# EasyEDA Pro project ProProject_Driver_STM32F405_2023-10-07.epro, schematic Schematic1_5
Create Date: 2023-04-22; Page Name: P1; Project Name: Driver_STM32F405; Schematic Name: Schematic1_5; Update Date: 2023-06-13; Company: 嘉立创EDA; Page Size: A4; Version: V1.0
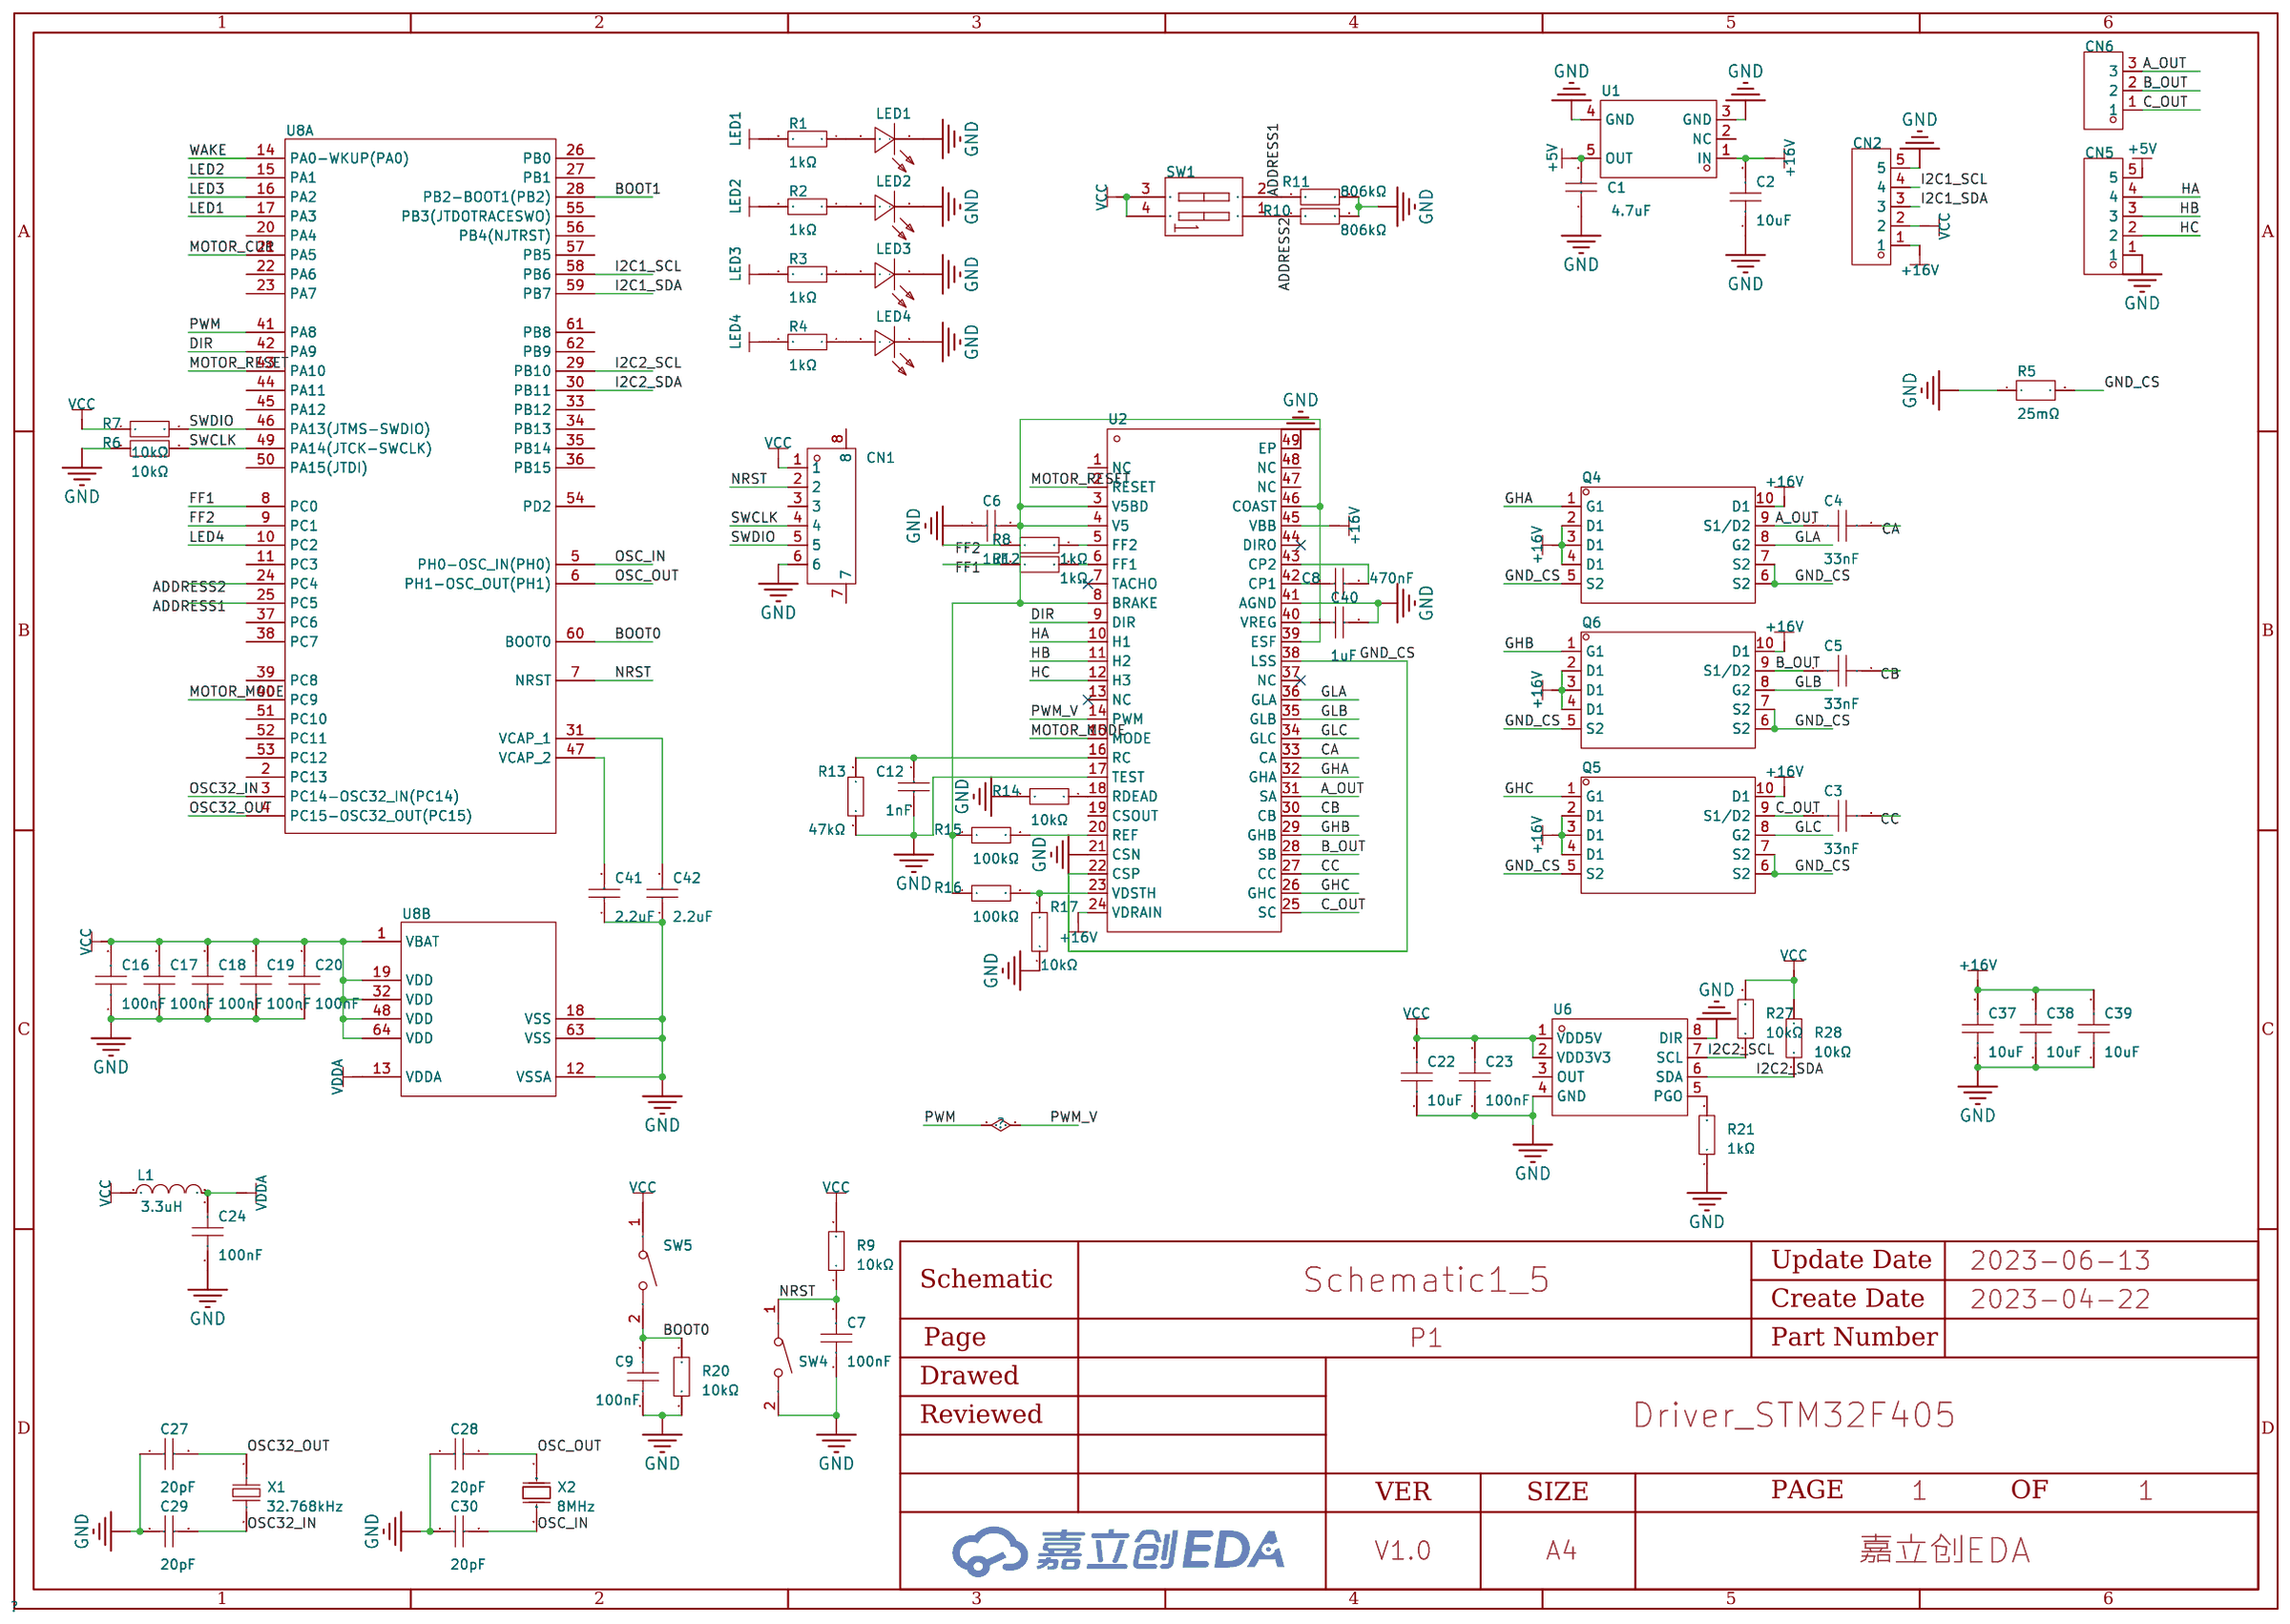
[diagram p1: schematic sheet]

## Parts
C1  4.7uF  [C0603]
C2  10uF  [C0603]
C3  33nF  [C0603]
C4  33nF  [C0603]
C5  33nF  [C0603]
C6  1uF  [C0603]
C7  100nF  [C0603]
C8  470nF  [C0603]
C9  100nF  [C0603]
C12  1nF  [C0603]
C16  100nF  [C0603]
C17  100nF  [C0603]
C18  100nF  [C0603]
C19  100nF  [C0603]
C20  100nF  [C0603]
C22  10uF  [C0603]
C23  100nF  [C0603]
C24  100nF  [C0603]
C27  20pF  [C0603]
C28  20pF  [C0603]
C29  20pF  [C0603]
C30  20pF  [C0603]
C37  10uF  [C1206]
C38  10uF  [C1206]
C39  10uF  [C1206]
C40  1uF  [C0603]
C41  2.2uF  [C0603]
C42  2.2uF  [C0603]
CN1  532610671  [CONN-SMD_6P-P1.25_53261-0671]
CN2  5264-5AWD米色  [CONN-TH_5P-P2.50_5264-5AWD]
CN5  PH-5AW  [CONN-TH_5P-P2.00_PH-5AW_C2908637]
CN6  PH-3AW  [CONN-TH_3P-P2.00_HCTL_PH-3AW_C2908635]
L1  3.3uH  [L0603]
LED1  SZYY0805B  [LED0805-R-RD_BLUE]
LED2  SZYY0805B  [LED0805-R-RD_BLUE]
LED3  SZYY0805B  [LED0805-R-RD_BLUE]
LED4  SZYY0805B  [LED0805-R-RD_BLUE]
Q4  DMT3009LDT-7  [V-DFN3030-8K_L3.0-W3.0-P0.65-BL]
Q5  DMT3009LDT-7  [V-DFN3030-8K_L3.0-W3.0-P0.65-BL]
Q6  DMT3009LDT-7  [V-DFN3030-8K_L3.0-W3.0-P0.65-BL]
R1  1kΩ  [R0603]
R2  1kΩ  [R0603]
R3  1kΩ  [R0603]
R4  1kΩ  [R0603]
R5  25mΩ  [RES-SMD_L6.4-W3.2-R2512]
R6  10kΩ  [R0603]
R7  10kΩ  [R0603]
R8  1kΩ  [R0603]
R9  10kΩ  [R0603]
R10  806kΩ  [R0603]
R11  806kΩ  [R0603]
R12  1kΩ  [R0603]
R13  47kΩ  [R0603]
R14  10kΩ  [R0603]
R15  100kΩ  [R0603]
R16  100kΩ  [R0603]
R17  10kΩ  [R0603]
R20  10kΩ  [R0603]
R21  1kΩ  [R0603]
R27  10kΩ  [R0603]
R28  10kΩ  [R0603]
SW1  DSHP02TSGER  [SW-SMD_DSHP02TSGER]
SW4  TS-1088-AR02016  [SW-SMD_L3.9-W3.0-P4.45]
SW5  TS-1088-AR02016  [SW-SMD_L3.9-W3.0-P4.45]
U1  TPS7B6950DBVR  [SOT-23-5_L3.0-W1.7-P0.95-LS2.8-BL]
U2  A3930KJPTR-T  [LQFP-48_L7.0-W7.0-P0.50-LS9.0-BL-EP]
U6  AS5600-ASOT  [SOIC-8_L5.0-W4.0-P1.27-LS6.0-BL]
U8  STM32F405RGT6  [LQFP-64_L10.0-W10.0-P0.50-LS12.0-BL]  (sections 1,2)
X1  32.768kHz  [FC-135R_L3.2-W1.5]
X2  8MHz  [CRYSTAL-SMD_L5.0-W3.2]

## Library data of the parts
C1 = CL10A475KO8NNNC: 温度系数:X5R;精度:±10%;容值:4.7uF;额定电压:16V;; LCSC Part Name: 4.7uF ±10% 16V; Supplier Part: C19666; Manufacturer: SAMSUNG(三星); Supplier Footprint: 0603; JLCPCB Part Class: Basic Part; Datasheet: https://atta.szlcsc.com/upload/public/pdf/source/20160103/1457707703134.pdf; Supplier: LCSC; Temperature Coefficient: X5R; Tolerance: ±10%; Voltage Rated: 16V
C2 C22 = GRM188C80G106KE47D: 容值:10uF;精度:±10%;额定电压:-;材质(温度系数):-;; LCSC Part Name: 10uF ±10%; Supplier Part: C710916; Manufacturer: muRata(村田); Supplier Footprint: 0603; JLCPCB Part Class: Extended Part; Datasheet: https://atta.szlcsc.com/upload/public/pdf/source/20210205/C710916_8901BCC8D8E6CC54F2C999D22152DEF1.pdf; Supplier: LCSC; Tolerance: ±10%
C3-C5 = CL10B333JB8NNNC: 容值:33nF;精度:±5%;额定电压:50V;材质(温度系数):X7R;; LCSC Part Name: 33nF ±5% 50V; Supplier Part: C377760; Manufacturer: SAMSUNG(三星); Supplier Footprint: 0603; JLCPCB Part Class: Extended Part; Datasheet: https://atta.szlcsc.com/upload/public/pdf/source/20190322/C377760_4801615B1239BA7CCDCF452430F04471.pdf; Supplier: LCSC; Tolerance: ±5%; Voltage Rated: 50V; Temperature Coefficient: X7R
C6 C40 = CL10A105KB8NNNC: 容值:1uF;精度:±10%;额定电压:50V;材质(温度系数):X5R;; LCSC Part Name: 1uF ±10% 50V; Supplier Part: C15849; Manufacturer: SAMSUNG(三星); Supplier Footprint: 0603; JLCPCB Part Class: Basic Part; Datasheet: https://atta.szlcsc.com/upload/public/pdf/source/20160103/1457707679084.pdf; Supplier: LCSC; Tolerance: ±10%; Voltage Rated: 50V; Temperature Coefficient: X5R
C7 C9 C16-C20 C23 C24 = TCC0603X7R104K500CT: 容值:100nF;精度:±10%;额定电压:50V;材质(温度系数):X7R;; LCSC Part Name: 100nF ±10% 50V; Supplier Part: C282519; Manufacturer: CCTC(三环); Supplier Footprint: 0603; JLCPCB Part Class: Extended Part; Datasheet: https://atta.szlcsc.com/upload/public/pdf/source/20180917/C282519_8CE721FA29EE85BB321020B63D7877A0.pdf; Supplier: LCSC; Tolerance: ±10%; Voltage Rated: 50V; Temperature Coefficient: X7R
C8 = 0603B474K500NT: 容值:470nF;精度:±10%;额定电压:50V;材质(温度系数):X7R;; LCSC Part Name: 470nF ±10% 50V; Supplier Part: C77572; Manufacturer: FH(风华); Supplier Footprint: 0603; JLCPCB Part Class: Extended Part; Datasheet: https://atta.szlcsc.com/upload/public/pdf/source/20170923/C77572_1506149543326988941.pdf; Supplier: LCSC; Tolerance: ±10%; Voltage Rated: 50V; Temperature Coefficient: X7R
C12 = CL10B102KB8NNNC: 容值:1nF;精度:±10%;额定电压:50V;材质(温度系数):X7R;; LCSC Part Name: 1nF ±10% 50V; Supplier Part: C1588; Manufacturer: SAMSUNG(三星); Supplier Footprint: 0603; JLCPCB Part Class: Basic Part; Datasheet: https://atta.szlcsc.com/upload/public/pdf/source/20160103/1457707679526.pdf; Supplier: LCSC; Tolerance: ±10%; Voltage Rated: 50V; Temperature Coefficient: X7R
C27-C30 = CL10C200JB8NNNC: 容值:20pF;精度:±5%;额定电压:50V;材质(温度系数):C0G;; LCSC Part Name: 20pF ±5% 50V; Supplier Part: C1648; Manufacturer: SAMSUNG(三星); Supplier Footprint: 0603; JLCPCB Part Class: Basic Part; Datasheet: https://atta.szlcsc.com/upload/public/pdf/source/20160103/1457707686863.pdf; Supplier: LCSC; Tolerance: ±5%; Voltage Rated: 50V; Temperature Coefficient: C0G
C37-C39 = GRM31CB31H106KA12L: 容值:10uF;精度:±10%;额定电压:50V;材质(温度系数):B;; LCSC Part Name: 10uF ±10% 50V; Supplier Part: C521234; Manufacturer: muRata(村田); Supplier Footprint: 1206; JLCPCB Part Class: Extended Part; Datasheet: https://atta.szlcsc.com/upload/public/pdf/source/20200424/C521234_36A2086CC2FC59561FA20FEB9FAD436A.pdf; Supplier: LCSC; Tolerance: ±10%; Voltage Rated: 50V; Temperature Coefficient: B
C41 C42 = CL10A225KO8NNNC: 容值:2.2uF;精度:±10%;额定电压:16V;材质(温度系数):X5R;; LCSC Part Name: 2.2uF ±10% 16V; Supplier Part: C23630; Manufacturer: SAMSUNG(三星); Supplier Footprint: 0603; JLCPCB Part Class: Basic Part; Datasheet: https://atta.szlcsc.com/upload/public/pdf/source/20160103/1457707709512.pdf; Supplier: LCSC; Tolerance: ±10%; Voltage Rated: 16V; Temperature Coefficient: X5R
CN1 = 532610671: 参考系列:-;间距:1.25mm;插针结构:1x6P;排数:1;每排PIN数:6;行距:-;安装方式:-;触头材质:青铜;; LCSC Part Name: 1.25mm 1x6P; Supplier Part: C99277; Manufacturer: MOLEX; JLCPCB Part Class: Extended Part; Datasheet: https://atta.szlcsc.com/upload/public/pdf/source/20180713/C99277_7A4A98FEF11A2209B5FFC17F14BF7E54.pdf; Supplier: LCSC; Pitch: 1.25mm; Pins Structure: 1x6P; Number of Rows: 1; Number of PINs Per Row: 6; Contact Material: 青铜
CN2 = 5264-5AWD米色: 参考系列:-;间距:2.5mm;插针结构:1x5P;排数:1;每排PIN数:5;行距:-;安装方式:-;触头材质:磷青铜;; LCSC Part Name: 5264插座 1*5P 弯针 带定位; Supplier Part: C176652; Manufacturer: BOOMELE(博穆精密); Supplier Footprint: 插件,P=2.5mm; JLCPCB Part Class: Extended Part; Datasheet: https://atta.szlcsc.com/upload/public/pdf/source/20180125/C176652_15168701824541304803.pdf; Supplier: LCSC; Pitch: 2.5mm; Pins Structure: 1x5P; Number of Rows: 1; Number of PINs Per Row: 5; Contact Material: 磷青铜
CN5 = PH-5AW_C2908637: 参考系列:-;间距:2mm;插针结构:1x5P;排数:1;每排PIN数:5;行距:-;公母:公型插针;安装方式:弯插;额定电流:3A;工作温度范围:-20℃~+85℃;; LCSC Part Name: 2mm 1x5P 弯插; Supplier Part: C2908637; Manufacturer: HCTL(华灿天禄); Supplier Footprint: 弯插,P=2mm; JLCPCB Part Class: Extended Part; Datasheet: https://atta.szlcsc.com/upload/public/pdf/source/20211021/A565F63A87FDD0E69746DCB0C2A69E14.pdf; Supplier: LCSC; Pitch: 2mm; Pins Structure: 1x5P; Number of Rows: 1; Number of PINs Per Row: 5; Gender: 公型插针; Mounting Style: 弯插; Current Rating (Max): 3A; Operating Temperature Range: -20℃~+85℃
CN6 = PH-3AW_C2908635: 参考系列:-;间距:2mm;插针结构:1x3P;排数:1;每排PIN数:3;行距:-;公母:公型插针;安装方式:弯插;额定电流:3A;工作温度范围:-20℃~+85℃;; LCSC Part Name: 2mm 1x3P 弯插; Supplier Part: C2908635; Manufacturer: HCTL(华灿天禄); Supplier Footprint: 弯插,P=2mm; JLCPCB Part Class: Extended Part; Datasheet: https://atta.szlcsc.com/upload/public/pdf/source/20211021/A565F63A87FDD0E69746DCB0C2A69E14.pdf; Supplier: LCSC; Pitch: 2mm; Pins Structure: 1x3P; Number of Rows: 1; Number of PINs Per Row: 3; Gender: 公型插针; Mounting Style: 弯插; Current Rating (Max): 3A; Operating Temperature Range: -20℃~+85℃
L1 = CMI160808U3R3KT: 额定电流:15mA;电感值:3.3uH;精度:±10%;饱和电流(Isat):-;直流电阻(DCR):1Ω;; LCSC Part Name: 3.3uH ±10% 15mA 1Ω; Supplier Part: C139209; Manufacturer: FH(风华); Supplier Footprint: 0603; JLCPCB Part Class: Extended Part; Datasheet: https://atta.szlcsc.com/upload/public/pdf/source/20180412/C139209_76E8EB9664C870BAE46EFE11DEB22A4C.pdf; Supplier: LCSC; Rated Current: 15mA; Tolerance: ±10%; DC Resistance (DCR): 1Ω
LED1-LED4 = SZYY0805B: 发光颜色:蓝灯;二极管配置:-;透镜颜色:无色透明;主波长:460nm~475nm;峰值波长:469nm;色温:-;光通量(25时):-;测试电流:5mA;正向电压(VF):3.1V;发光强度:100mcd;功率:100mW;发光角度:120°;安装方式:-;工作温度:-40~+85;; LCSC Part Name: 蓝灯; Supplier Part: C434433; Manufacturer: yongyu(永裕光电); Supplier Footprint: 0805; JLCPCB Part Class: Extended Part; Datasheet: https://atta.szlcsc.com/upload/public/pdf/source/20191204/C434433_0B90CAB876449C52BDD12D5E48F83BBD.pdf; Supplier: LCSC; Emitted Color: 蓝灯; Lens Color: 无色透明; Dominant Wavelength: 460nm~475nm; Peak Wavelength: 469nm; Forward Current: 5mA; Forward Voltage (VF): 3.1V; Luminous Intensity: 100mcd; Power Dissipation: 100mW; Viewing Angle: 120°; Operating Temperature: -40~+85
Q4-Q6 = DMT3009LDT-7: 类型:双N沟道(半桥);漏源电压(Vdss):30V;连续漏极电流(Id):30A;功率(Pd):1.2W;导通电阻(RDS(on)@Vgs,Id):11.1mΩ@10V,14.4A;阈值电压(Vgs(th)@Id):3V@250uA;; LCSC Part Name: 双N沟道(半桥) 30V 30A; Supplier Part: C155503; Manufacturer: DIODES(美台); Supplier Footprint: V-DFN3030-8; JLCPCB Part Class: Extended Part; Datasheet: https://atta.szlcsc.com/upload/public/pdf/source/20181206/C155503_C9E5F849506B8E5BF51429E256EC4CEC.pdf; Supplier: LCSC; Type: 双N沟道(半桥); Drain Source Voltage (Vdss): 30V; Continuous Drain Current (Id): 30A; Power Dissipation (Pd): 1.2W; Drain Source On Resistance (RDS(on)@Vgs,Id): 11.1mΩ@10V,14.4A; Gate Threshold Voltage (Vgs(th)@Id): 3V@250uA
R1-R4 R8 R12 R21 = 0603WAF1001T5E: 电阻类型:厚膜电阻;阻值:1kΩ;精度:±1%;功率:100mW;温度系数:±100ppm/℃;最大工作电压:75V;工作温度范围:-55℃~+155℃;; LCSC Part Name: 1kΩ ±1% 100mW; Supplier Part: C21190; Manufacturer: UNI-ROYAL(厚声); Supplier Footprint: 0603; JLCPCB Part Class: Basic Part; Datasheet: https://atta.szlcsc.com/upload/public/pdf/source/20200306/C422600_1E6D84923E4A46A82E41ADD87F860B5C.pdf; Supplier: LCSC; Type: 厚膜电阻; Tolerance: ±1%; Power(Watts): 100mW; Temperature Coefficient: ±100ppm/℃; Overload Voltage (Max): 75V; Operating Temperature Range: -55℃~+155℃
R5 = HoJLR2512-3W-25mR-1%: 阻值:25mΩ;精度:±1%;功率:3W;温度系数:±50ppm/℃;工作温度范围:-50℃~+170℃;; LCSC Part Name: 25mΩ ±1% 3W; Supplier Part: C2903480; Manufacturer: Milliohm(毫欧); Supplier Footprint: 2512; JLCPCB Part Class: Extended Part; Datasheet: https://atta.szlcsc.com/upload/public/pdf/source/20211009/7525CABAB363C979E942C1DD41F1FEF0.pdf; Supplier: LCSC; Tolerance: ±1%; Power(Watts): 3W; Temperature Coefficient: ±50ppm/℃; Operating Temperature Range: -50℃~+170℃
R6 R7 R9 R14 R17 R20 R27 R28 = RC0603FR-0710KL: 电阻类型:厚膜电阻;阻值:10kΩ;精度:±1%;功率:100mW;温度系数:±100ppm/℃;最大工作电压:75V;工作温度范围:-55℃~+155℃;; LCSC Part Name: 10kΩ ±1% 100mW; Supplier Part: C98220; Manufacturer: YAGEO(国巨); Supplier Footprint: 0603; JLCPCB Part Class: Extended Part; Datasheet: https://atta.szlcsc.com/upload/public/pdf/source/20170522/1495423494387.pdf; Supplier: LCSC; Type: 厚膜电阻; Tolerance: ±1%; Power(Watts): 100mW; Temperature Coefficient: ±100ppm/℃; Overload Voltage (Max): 75V; Operating Temperature Range: -55℃~+155℃
R10 R11 = 0603WAF8063T5E: 精度:±1%;阻值:806kΩ;温度系数:±100ppm/℃;功率:1/10W;最大工作电压:75V;工作温度范围:-55℃~+155℃;; LCSC Part Name: 806KΩ ±1%; Supplier Part: C23250; Manufacturer: UNI-ROYAL(厚声); Supplier Footprint: 0603; JLCPCB Part Class: Extended Part; Datasheet: https://atta.szlcsc.com/upload/public/pdf/source/20170920/C23250_1505901154958982629.pdf; Supplier: LCSC; Tolerance: ±1%; Temperature Coefficient: ±100ppm/℃; Power(Watts): 1/10W; Overload Voltage (Max): 75V; Operating Temperature Range: -55℃~+155℃
R13 = 0603WAF4702T5E: 精度:±1%;温度系数:±100ppm/℃;功率:1/10W;阻值:47kΩ;最大工作电压:75V;工作温度范围:-55℃~+155℃;; LCSC Part Name: 47KΩ ±1%; Supplier Part: C25819; Manufacturer: UNI-ROYAL(厚声); Supplier Footprint: 0603; JLCPCB Part Class: Basic Part; Datasheet: https://atta.szlcsc.com/upload/public/pdf/source/20170920/C25819_1505901557326983389.pdf; Supplier: LCSC; Tolerance: ±1%; Temperature Coefficient: ±100ppm/℃; Power(Watts): 1/10W; Overload Voltage (Max): 75V; Operating Temperature Range: -55℃~+155℃
R15 R16 = 0603WAF1003T5E: 电阻类型:厚膜电阻;阻值:100kΩ;精度:±1%;功率:100mW;温度系数:±100ppm/℃;最大工作电压:75V;工作温度范围:-55℃~+155℃;; LCSC Part Name: 100kΩ ±1% 100mW; Supplier Part: C25803; Manufacturer: UNI-ROYAL(厚声); Supplier Footprint: 0603; JLCPCB Part Class: Basic Part; Datasheet: https://atta.szlcsc.com/upload/public/pdf/source/20200306/C422600_1E6D84923E4A46A82E41ADD87F860B5C.pdf; Supplier: LCSC; Type: 厚膜电阻; Tolerance: ±1%; Power(Watts): 100mW; Temperature Coefficient: ±100ppm/℃; Overload Voltage (Max): 75V; Operating Temperature Range: -55℃~+155℃
SW1 = DSHP02TSGER: 类型:平拨，凹槽式;电路结构:单刀单掷;开关位数:2;引脚间距:1.27mm;颜色:黑色;; LCSC Part Name: 2位 1.27间距; Supplier Part: C367376; Manufacturer: YE; Supplier Footprint: SMD-4P,4.1x5.4mm; JLCPCB Part Class: Extended Part; Datasheet: https://atta.szlcsc.com/upload/public/pdf/source/20190604/C367376_CB5658EC78844F4C2243AD86B8AB208E.pdf; Supplier: LCSC; Type: 平拨，凹槽式; Circuit: 单刀单掷; Number of Positions: 2; Lead Pitch: 1.27mm; Color: 黑色
SW4 SW5 = TS-1088-AR02016: 触点电流:50mA;额定电压(DC):12V;绝缘电阻:100MΩ;电路结构:单刀单掷;安装方式:立贴;按钮形状:圆形按钮;按钮/盖帽颜色:黑色;作用力:160gf@±50gf;机械寿命:100000;工作温度:-30℃~+80℃;引脚样式:SMD接片;开关长度:4mm;开关宽度:3mm;开关高度:2mm;带支架:否;; LCSC Part Name: 3x4x2.0 160gf 贴片无柱轻触开关; Supplier Part: C720477; Manufacturer: XUNPU(讯普); Supplier Footprint: SMD; JLCPCB Part Class: Extended Part; Datasheet: https://atta.szlcsc.com/upload/public/pdf/source/20200810/C720475_60D09DD6C54279ADDB2DC25100F1CC11.pdf; Supplier: LCSC; Contact Current: 50mA; Voltage Rating (DC): 12V; Insulation Resistance: 100MΩ; Circuit: 单刀单掷; Mounting Style: 立贴; Actuator Style: 圆形按钮; Actuator/Cap Color: 黑色; Operating Force: 160gf@±50gf; Mechanical Life: 100000; Operating Temperature: -30℃~+80℃; Pin Style: SMD接片; Switch Length: 4mm; Switch Width: 3mm; Switch Height: 2mm; Strike Gundam: 否
U1 = TPS7B6950DBVR: 输出类型:固定;输出极性:正;输出通道数:1;最大输入电压:40V;输出电压:5V;压差:800mV@(100mA);输出电流:150mA;电源纹波抑制比(PSRR):60dB@(100Hz);; LCSC Part Name: 正 Vin=40V Vout=5V 150mA 60dB@(100Hz); Supplier Part: C174327; Manufacturer: TI(德州仪器); Supplier Footprint: SOT-23-5; JLCPCB Part Class: Extended Part; Datasheet: https://atta.szlcsc.com/upload/public/pdf/source/20180202/C174327_15175649229381336371.pdf; Supplier: LCSC; Output Type: 固定; Output Polarity: 正; Number of Outputs: 1; Maximum Input Voltage: 40V; Output Voltage: 5V; Dropout Voltage: 800mV@(100mA); Output Current: 150mA; Power Supply Rejection Ratio (PSRR): 60dB@(100Hz)
U2 = A3930KJPTR-T: 电源电压:5.5V~50V;输出电流:-;接口:并行;; LCSC Part Name: 电机驱动芯片; Supplier Part: C459252; Manufacturer: ALLEGRO(美国埃戈罗); Supplier Footprint: LQFP-48(7x7); JLCPCB Part Class: Extended Part; Datasheet: https://atta.szlcsc.com/upload/public/pdf/source/20200518/C459252_E214869B5841466FF326F30C716B8FBE.pdf; Supplier: LCSC; Type: 无刷直流BLDC; Supply Voltage: 5.5V~50V; Interface: 并行; Operating Temperature: -40℃~+150℃@(Ta)
U6 = AS5600-ASOT: Supplier Part: C499458; Manufacturer: ams(艾迈斯半导体); Supplier Footprint: SOIC-8; JLCPCB Part Class: Extended Part; Datasheet: https://atta.szlcsc.com/upload/public/pdf/source/20200324/C499458_E1461AFB0CE1042DE5756821C534625C.pdf; Supplier: LCSC
U8 = STM32F405RGT6: CPU内核:ARM Cortex-M4;CPU最大主频:168MHz;工作电压范围:1.8V~3.6V;内部振荡器:有;程序 FLASH容量:1MB;RAM总容量:192KB;EEPROM/数据 FLASH容量:-;GPIO端口数量:51;ADC(单元数/通道数/位数):1@x16ch/12bit;DAC(单元数/通道数/位数):1@x2ch/12bit;外设/功能/协议栈:欠压检测/复位；DMA；LCD驱动；看门狗；POR；PWM;工作温度范围:-40℃~+85℃;; LCSC Part Name: ARM Cortex-M4 168MHz 闪存：1MB RAM：192KB; Supplier Part: C15742; Manufacturer: ST(意法半导体); Supplier Footprint: LQFP-64(10x10); JLCPCB Part Class: Extended Part; Datasheet: https://atta.szlcsc.com/upload/public/pdf/source/20140724/1457707160365.pdf; Supplier: LCSC; CPU Core: ARM Cortex-M4; Maximum Frequency: 168MHz; Supply Voltage Range: 1.8V~3.6V; Internal Oscillator: 有; Program FLASH Size: 1MB; RAM Size: 192KB; GPIO Ports Number: 51; ADC (Units/Channels/bits): 1@x16ch/12bit; DAC (Units/Channels/bits): 1@x2ch/12bit; Peripherals / Functions / Protocol Stacks: 欠压检测/复位；DMA；LCD驱动；看门狗；POR；PWM; Operating Temperature Range: -40℃~+85℃
X1 = Q13FC1350000400: 晶振类型:贴片无源晶振;频率:32.768kHz;频率公差:±20ppm;负载电容:12.5pF;等效串联电阻(ESR):70kΩ;工作温度:-40℃~+85℃;; LCSC Part Name: 32.768kHz ±20ppm 12.5pF; Supplier Part: C32346; Manufacturer: EPSON(爱普生); Supplier Footprint: SMD3215-2P; JLCPCB Part Class: Basic Part; Datasheet: https://atta.szlcsc.com/upload/public/pdf/source/20190108/C32346_746D6B07EAF90824457A96480007685F.pdf; Supplier: LCSC; Crystal Type: 贴片无源晶振; Frequency Tolerance: ±20ppm; Load Capacitance: 12.5pF; Equivalent Series Resistance (ESR): 70kΩ; Operating Temperature: -40℃~+85℃
X2 = X50328MSB2GI: 晶振类型:贴片无源晶振;频率:8MHz;频率公差:±10ppm;频率稳定度:±50ppm;负载电容:20pF;工作温度:-40℃~+85℃;; LCSC Part Name: YSX530GA 8MHz ±10ppm 20pF; Supplier Part: C115962; Manufacturer: YXC(扬兴晶振); Supplier Footprint: SMD5032-2P; JLCPCB Part Class: Basic Part; Datasheet: https://atta.szlcsc.com/upload/public/pdf/source/20210329/C112559_847D3CACBA33ACCEB57DEA3AEBB187A1.pdf; Supplier: LCSC; Crystal Type: 贴片无源晶振; Frequency Tolerance: ±10ppm; Frequency Stability: ±50ppm; Load Capacitance: 20pF; Operating Temperature: -40℃~+85℃

## Nets
+5V: C1.2 CN5.5 U1.5(OUT)
+16V: C2.2 C37.2 C38.2 C39.2 CN2.1 Q4.2(D1) Q4.3(D1) Q4.4(D1) Q4.10(D1) Q5.2(D1) Q5.3(D1) Q5.4(D1) Q5.10(D1) Q6.2(D1) Q6.3(D1) Q6.4(D1) Q6.10(D1) U1.1(IN) U2.24(VDRAIN) U2.45(VBB)
GND: C1.1 C2.1 C6.1 C7.1 C9.2 C12.1 C16.1 C17.1 C18.1 C19.1 C20.1 C22.1 C23.1 C24.1 C27.1 C28.1 C29.1 C30.1 C37.1 C38.1 C39.1 C40.2 C41.1 C42.1 CN1.6 CN2.5 CN5.1 LED1.2(-) LED2.2(-) LED3.2(-) LED4.2(-) R5.1 R6.1 R10.2 R11.2 R13.1 R14.2 R17.1 R20.2 R21.1 SW4.2 U1.3(GND) U1.4(GND) U2.17(TEST) U2.21(CSN) U2.41(AGND) U2.49(EP) U6.4(GND) U6.8(DIR) U8.12(VSSA) U8.18(VSS) U8.63(VSS)
GND_CS: Q4.5(S2) Q4.6(S2) Q4.7(S2) Q5.5(S2) Q5.6(S2) Q5.7(S2) Q6.5(S2) Q6.6(S2) Q6.7(S2) R5.2 U2.22(CSP) U2.38(LSS)
VCC: C16.2 C17.2 C18.2 C19.2 C20.2 C22.2 C23.2 CN1.1 CN2.2 L1.1 R7.1 R9.2 R27.2 R28.2 SW1.3(B2) SW1.4(B1) SW5.1 U6.1(VDD5V) U6.2(VDD3V3) U8.1(VBAT) U8.19(VDD) U8.32(VDD) U8.48(VDD) U8.64(VDD)
VDDA: C24.2 L1.2 U8.13(VDDA)
A_OUT: C4.2 CN6.3 Q4.9(S1/D2) U2.31(SA)
ADDRESS1: R11.1 SW1.2(A2) U8.25(PC5)
ADDRESS2: R10.1 SW1.1(A1) U8.24(PC4)
B_OUT: C5.2 CN6.2 Q6.9(S1/D2) U2.28(SB)
BOOT0: C9.1 R20.1 SW5.2 U8.60(BOOT0)
BOOT1: U8.28(PB2-BOOT1(PB2))
C_OUT: C3.2 CN6.1 Q5.9(S1/D2) U2.25(SC)
CA: C4.1 U2.33(CA)
CB: C5.1 U2.30(CB)
CC: C3.1 U2.27(CC)
DIR: U2.9(DIR) U8.42(PA9)
FF1: R12.1 U8.8(PC0)
FF2: R8.1 U8.9(PC1)
GHA: Q4.1(G1) U2.32(GHA)
GHB: Q6.1(G1) U2.29(GHB)
GHC: Q5.1(G1) U2.26(GHC)
GLA: Q4.8(G2) U2.36(GLA)
GLB: Q6.8(G2) U2.35(GLB)
GLC: Q5.8(G2) U2.34(GLC)
HA: CN5.4 U2.10(H1)
HB: CN5.3 U2.11(H2)
HC: CN5.2 U2.12(H3)
I2C1_SCL: CN2.4 U8.58(PB6)
I2C1_SDA: CN2.3 U8.59(PB7)
I2C2_SCL: R27.1 U6.7(SCL) U8.29(PB10)
I2C2_SDA: R28.1 U6.6(SDA) U8.30(PB11)
LED1: R1.2 U8.17(PA3)
LED2: R2.2 U8.15(PA1)
LED3: R3.2 U8.16(PA2)
LED4: R4.2 U8.10(PC2)
MOTOR_CUR: U8.21(PA5)
MOTOR_MODE: U2.15(MODE) U8.40(PC9)
MOTOR_RESET: U2.2(RESET) U8.43(PA10)
NRST: C7.2 CN1.2 R9.1 SW4.1 U8.7(NRST)
OSC32_IN: C29.2 U8.3(PC14-OSC32_IN(PC14)) X1.2
OSC32_OUT: C27.2 U8.4(PC15-OSC32_OUT(PC15)) X1.1
OSC_IN: C30.2 U8.5(PH0-OSC_IN(PH0)) X2.2(OSC2)
OSC_OUT: C28.2 U8.6(PH1-OSC_OUT(PH1)) X2.1(OSC1)
PWM: U2.14(PWM) U8.41(PA8)
SWCLK: CN1.4 R6.2 U8.49(PA14(JTCK-SWCLK))
SWDIO: CN1.5 R7.2 U8.46(PA13(JTMS-SWDIO))
WAKE: U8.14(PA0-WKUP(PA0))
$1N4505: C41.2 U8.47(VCAP_2)
$1N4511: C42.2 U8.31(VCAP_1)
$1N21748: C8.1 U2.42(CP1)
$1N21864: C8.2 U2.43(CP2)
$1N22637: C12.2 R13.2 U2.16(RC)
$1N23232: C40.1 U2.40(VREG)
$1N23481: C6.2 R15.1 R16.1 U2.3(V5BD) U2.4(V5) U2.8(BRAKE) U2.39(ESF) U2.46(COAST)
$1N24997: R15.2 U2.20(REF)
$1N25176: R16.2 R17.2 U2.23(VDSTH)
$1N27489: R14.1 U2.18(RDEAD)
$1N33277: R21.2 U6.5(PGO)
$1N35265: LED1.1(+) R1.1
$1N35679: LED2.1(+) R2.1
$1N35970: LED3.1(+) R3.1
$1N38182: LED4.1(+) R4.1
$1N68839: R8.2 U2.5(FF2)
$1N68841: R12.2 U2.6(FF1)

Not connected (* = marked no-connect by the designer): CN1 3 7 8; U1 2(NC); U2 1(NC) 7(TACHO)* 13(NC)* 19(CSOUT) 37(NC)* 44(DIRO)* 47(NC) 48(NC); U6 3(OUT); U8 2(PC13) 11(PC3) 20(PA4) 22(PA6) 23(PA7) 26(PB0) 27(PB1) 33(PB12) 34(PB13) 35(PB14) 36(PB15) 37(PC6) 38(PC7) 39(PC8) 44(PA11) 45(PA12) 50(PA15(JTDI)) 51(PC10) 52(PC11) 53(PC12) 54(PD2) 55(PB3(JTDOTRACESWO)) 56(PB4(NJTRST)) 57(PB5) 61(PB8) 62(PB9)
